# Altium schematic sheet Wifi.SchDoc
size A4
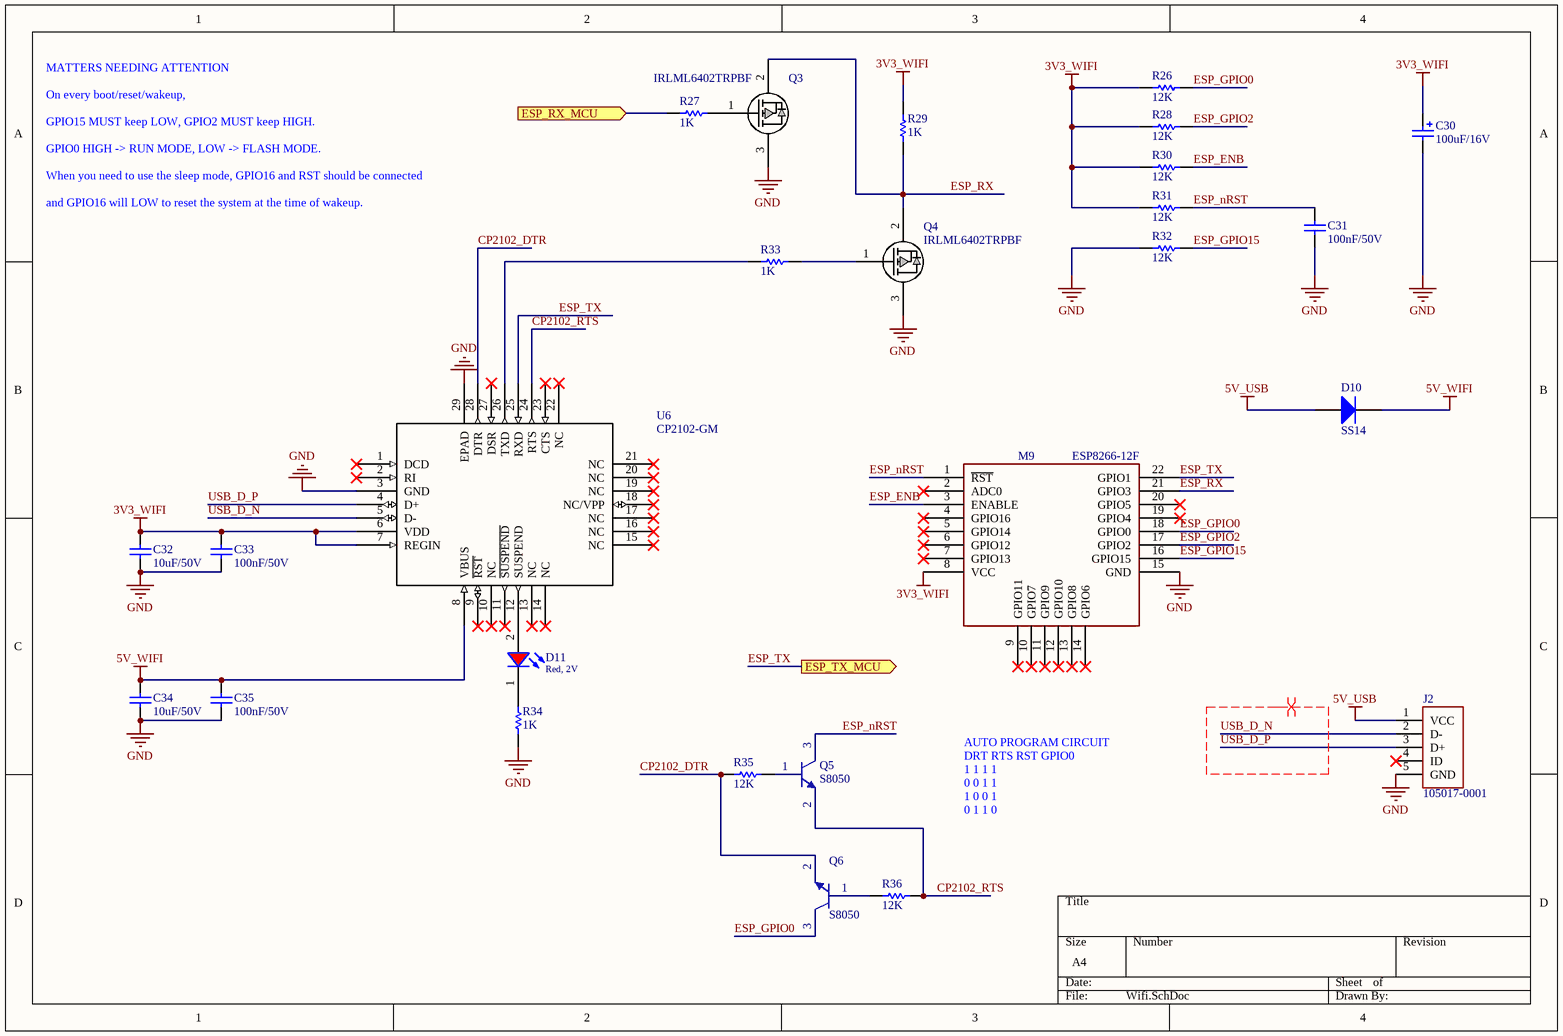
[diagram p0: Wifi.SchDoc]

## Parts
C30  value 100uF/16V  [CAP_SM_TAN]  (hidden comment: TAJB107M006RNJ)
C31  value 100nF/50V  [CAP-SM-0805]  (hidden comment: Cap-100nF-50V-0805)
C32  value 10uF/50V  [CAP-SM-0805]  (hidden comment: Cap-10uF-50V-0805)
C33  value 100nF/50V  [CAP-SM-0805]  (hidden comment: Cap-100nF-50V-0805)
C34  value 10uF/50V  [CAP-SM-0805]  (hidden comment: Cap-10uF-50V-0805)
C35  value 100nF/50V  [CAP-SM-0805]  (hidden comment: Cap-100nF-50V-0805)
D10  SS14  [SS14]
D11  Red, 2V  [WL-SMCW_0805]
J2  105017-0001  [CONN_105017-0001]
M9  ESP8266-12F  [ESP8266-12F]
Q3  IRLML6402TRPBF  [IRLML6402TRPBF]
Q4  IRLML6402TRPBF  [IRLML6402TRPBF]
Q5  S8050  [SOT23_NEX]
Q6  S8050  [SOT23_NEX]
R26  value 12K  [RES-SM-0805]  (hidden comment: Res-12K-0805)
R27  value 1K  [RES-SM-0805]  (hidden comment: Res-1K-0805)
R28  value 12K  [RES-SM-0805]  (hidden comment: Res-12K-0805)
R29  value 1K  [RES-SM-0805]  (hidden comment: Res-1K-0805)
R30  value 12K  [RES-SM-0805]  (hidden comment: Res-12K-0805)
R31  value 12K  [RES-SM-0805]  (hidden comment: Res-12K-0805)
R32  value 12K  [RES-SM-0805]  (hidden comment: Res-12K-0805)
R33  value 1K  [RES-SM-0805]  (hidden comment: Res-1K-0805)
R34  value 1K  [RES-SM-0805]  (hidden comment: Res-1K-0805)
R35  value 12K  [RES-SM-0805]  (hidden comment: Res-12K-0805)
R36  value 12K  [RES-SM-0805]  (hidden comment: Res-12K-0805)
U6  CP2102-GM  [CP2102-GM]

## Ports
ESP_RX_MCU (in), ESP_TX_MCU (out)

## Nets
3V3_WIFI: C30.1 C32.2 C33.1 M9.8(VCC) R26.1 R28.1 R29.2 R30.1 R31.1 U6.6(VDD) U6.7(REGIN)
5V_USB: D10.2(A) J2.1(VCC)
5V_WIFI: C34.2 C35.1 D10.1(K) U6.8(VBUS)
GND: C30.2 C31.2 C32.1 C33.2 C34.1 C35.2 J2.5(GND) M9.15(GND) Q3.3(S) Q4.3(S) R32.1 R34.1 U6.3(GND) U6.29(EPAD)
CP2102_DTR: Q6.2(E) R35.1 U6.28(DTR)
CP2102_RTS: Q5.2(E) R36.2 U6.24(RTS)
ESP_ENB: M9.3(ENABLE) R30.2
ESP_GPIO0: M9.18(GPIO0) Q6.3(C) R26.2
ESP_GPIO2: M9.17(GPIO2) R28.2
ESP_GPIO15: M9.16(GPIO15) R32.2
ESP_nRST: C31.1 M9.1(~{RST}) Q5.3(C) R31.2
ESP_RX: M9.21(GPIO3) Q3.2(D) Q4.2(D) R29.1
ESP_RX_MCU: R27.1 ; port ESP_RX_MCU
ESP_TX: M9.22(GPIO1) U6.25(RXD) ; port ESP_TX_MCU
USB_D_N: J2.2(D-) U6.5(D-)
USB_D_P: J2.3(D+) U6.4(D+)
NetD11_1: D11.1(K) R34.2
NetD11_2: D11.2(A) U6.12(SUSPEND)
NetQ3_1: Q3.1(G) R27.2
NetQ4_1: Q4.1(G) R33.2
NetQ5_1: Q5.1(B) R35.2
NetQ6_1: Q6.1(B) R36.1
NetR33_1: R33.1 U6.26(TXD)

Not connected (* = marked no-connect by the designer): J2 4(ID)*; M9 2(ADC0)* 4(GPIO16)* 5(GPIO14)* 6(GPIO12)* 7(GPIO13)* 9(GPIO11)* 10(GPIO7)* 11(GPIO9)* 12(GPIO10)* 13(GPIO8)* 14(GPIO6)* 19(GPIO4)* 20(GPIO5)*; U6 1(DCD)* 2(RI)* 9(~{RST})* 10(NC)* 11(~{SUSPEND})* 13(NC)* 14(NC)* 15(NC)* 16(NC)* 17(NC)* 18(NC/VPP)* 19(NC)* 20(NC)* 21(NC)* 22(NC)* 23(CTS)* 27(DSR)*

## Layout directives
differential pair: USB_D_N, USB_D_P

## Notes on the sheet
- MATTERS NEEDING ATTENTION
- On every boot/reset/wakeup,
- GPIO15 MUST keep LOW, GPIO2 MUST keep HIGH.
- GPIO0 HIGH -> RUN MODE, LOW -> FLASH MODE.
- When you need to use the sleep mode, GPIO16 and RST should be connected
- and GPIO16 will LOW to reset the system at the time of wakeup.
- AUTO PROGRAM CIRCUIT
  DRT RTS RST GPIO0
  1 1 1 1
  0 0 1 1
  1 0 0 1
  0 1 1 0

## Library data of the parts
C30 = Cap-Tan-100uF-16V: Manufacturer: Nichicon; Manufacturer Part Number: UWX1C101MCL1GB; Local Supplier: icdayroi; Local Supplier Link: https://icdayroi.com/tu-tantalum-100uf-16v-smd6032; Supplier 1: Digikey; Supplier 1 Part Number: 493-2105-1-ND; Supplier 1 Link: https://www.digikey.com/product-detail/en/nichicon/UWX1C101MCL1GB/493-2105-1-ND/590080
C31 C33 C35 = Cap-100nF-50V-0805: CAP CER 0.1UF 50V Y5V 0805; Manufacturer: Samsung Electro-Mechanics; Manufacturer Part Number: CL21F104ZBCNNNC; Local Supplier: thegioiic; Local Supplier Link: https://thegioiic.com/products/tu-100nf-0-1uf-50v-0805; Supplier 1: Digikey; Supplier 1 Part Number: 1276-1007-1-ND; Supplier 1 Link: https://www.digikey.com/product-detail/en/samsung-electro-mechanics/CL21F104ZBCNNNC/1276-1007-1-ND/3889093
C32 C34 = Cap-10uF-50V-0805: CAP CER 10UF 50V X5R 0805; Manufacturer: Yageo; Manufacturer Part Number: CC0805KKX5R9BB106; Local Supplier: thegioiic; Local Supplier Link: https://thegioiic.com/products/tu-10uf-50v-0805; Supplier 1: Digikey; Supplier 1 Link: https://www.digikey.com/product-detail/en/yageo/CC0805KKX5R9BB106/311-3499-2-ND/7164383; Supplier 1 Part Number: 311-3499-2-ND
D10 = Diode-SS14: DIODE SCHOTTKY 40V 1A SMA; Manufacturer: ON Semiconductor; Local Supplier: thegioiic; Local Supplier Link: https://thegioiic.com/products/ss14-sma; Supplier 1: Digikey; Supplier 1 Link: https://www.digikey.com/product-detail/en/on-semiconductor/SS14/SS14CT-ND/965729; Manufacturer Part Number: SS14; Supplier 1 Part Number: SS14CT-ND
D11 = 150080RS75000: WL-SMCW SMT Mono-color Chip LED Waterclear, size 0805, Red, 2V, 140deg; Chip Technology: AlInGaP; Dominant Wavelength typ.: 625nm; Luminous Intensity typ.: 150mcd; Peak Wavelength typ.: 630nm; Viewing Angle: 140deg; ComponentLink1Description: Manufacturer; ComponentLink1URL: http://www.we-online.de; ComponentLink2URL: https://www.we-online.com/catalog/datasheet/150080RS75000.pdf; ComponentLink2Description: Datasheet; Forward Voltage typ.: 2V; Emitting Color: Red; Mounting Technology: SMT; Operating Temperature: -40 to +85degC; Published Date: December 2019; Part Number: 150080RS75000; Packaging: Tape and Reel; Size: 0805; Publisher: Wurth Elektronik
J2 = 105017-0001: No Description Available; Vendor: Molex Connector Corporation; Built_By: EMA_Cory; SourceLibrary: Molex_2020-05-26; Datasheet: https://www.molex.com/pdm_docs/sd/1050170001_sd.pdf; Manufacturer_Part_Number: 105017-0001; Copyright: Copyright (C) 2018 Accelerated Designs. All rights reserved; RefDes: RefDes; Type: DEV
Q3 Q4 = IRLML6402TRPBF: Source_Library: Infineon_2020-02-27.xlr; Built_By: EMA_Justin; SourceLibrary: Infineon_2020-02-27; Vendor: Infineon; Type: DEV; Copyright: Copyright (C) 2018 Accelerated Designs. All rights reserved; Manufacturer_Part_Number: IRLML6402TRPBF; RefDes: RefDes
R26 R28 R30-R32 R35 R36 = Res-12K-0805: RES 12 KOHM JUMPER 0805; Manufacturer: Vishay Thin Film; Manufacturer Part Number: PAT0805E3121BST1; Local Supplier: icdayroi; Local Supplier Link: https://icdayroi.com/dien-tro-12k-0805-1-goi-50-con; Supplier 1: Digikey; Supplier 1 Link: https://www.digikey.com/product-detail/en/vishay-thin-film/PAT0805E3121BST1/PAT0805E3121BST1-ND/2281536; Supplier 1 Part Number: PAT0805E3121BST1-ND
R27 R29 R33 R34 = Res-1K-0805: RES 1K OHM 1% 1/4W 0805; Manufacturer: Stackpole Electronics Inc; Manufacturer Part Number: RNCP0805FTD1K00; Local Supplier: thegioiic; Local Supplier Link: https://thegioiic.com/products/dien-tro-1k-ohm-0805-5; Supplier 1: Digikey; Supplier 1 Link: https://www.digikey.com/product-detail/en/stackpole-electronics-inc/RNCP0805FTD1K00/RNCP0805FTD1K00CT-ND/2240568; Supplier 1 Part Number: RNCP0805FTD1K00CT-ND
U6 = CP2102-GM: Manufacturer_Part_Number: CP2102-GMR; Vendor: Silicon Labs; Built_By: EMA_UL_Team; SourceLibrary: Silicon_Labs_2015-03-23; Copyright: Copyright (C) 2018 Accelerated Designs. All rights reserved; RefDes: RefDes; Type: DEV
M9 = ESP8266-12F: Local Supplier: HShop; Local Supplier Link: https://hshop.vn/products/mach-thu-phat-wifi-soc-esp8266-v12; Local Supplier Part Number: HS000912; Manufacturer: *; Manufacturer Part Number: *